# Altium schematic sheet dac-DAC7562.SchDoc: DAC7562
size A4; DrawnBy: Dylan Vogel; Organization: UTAT SS; Revision: 1.1
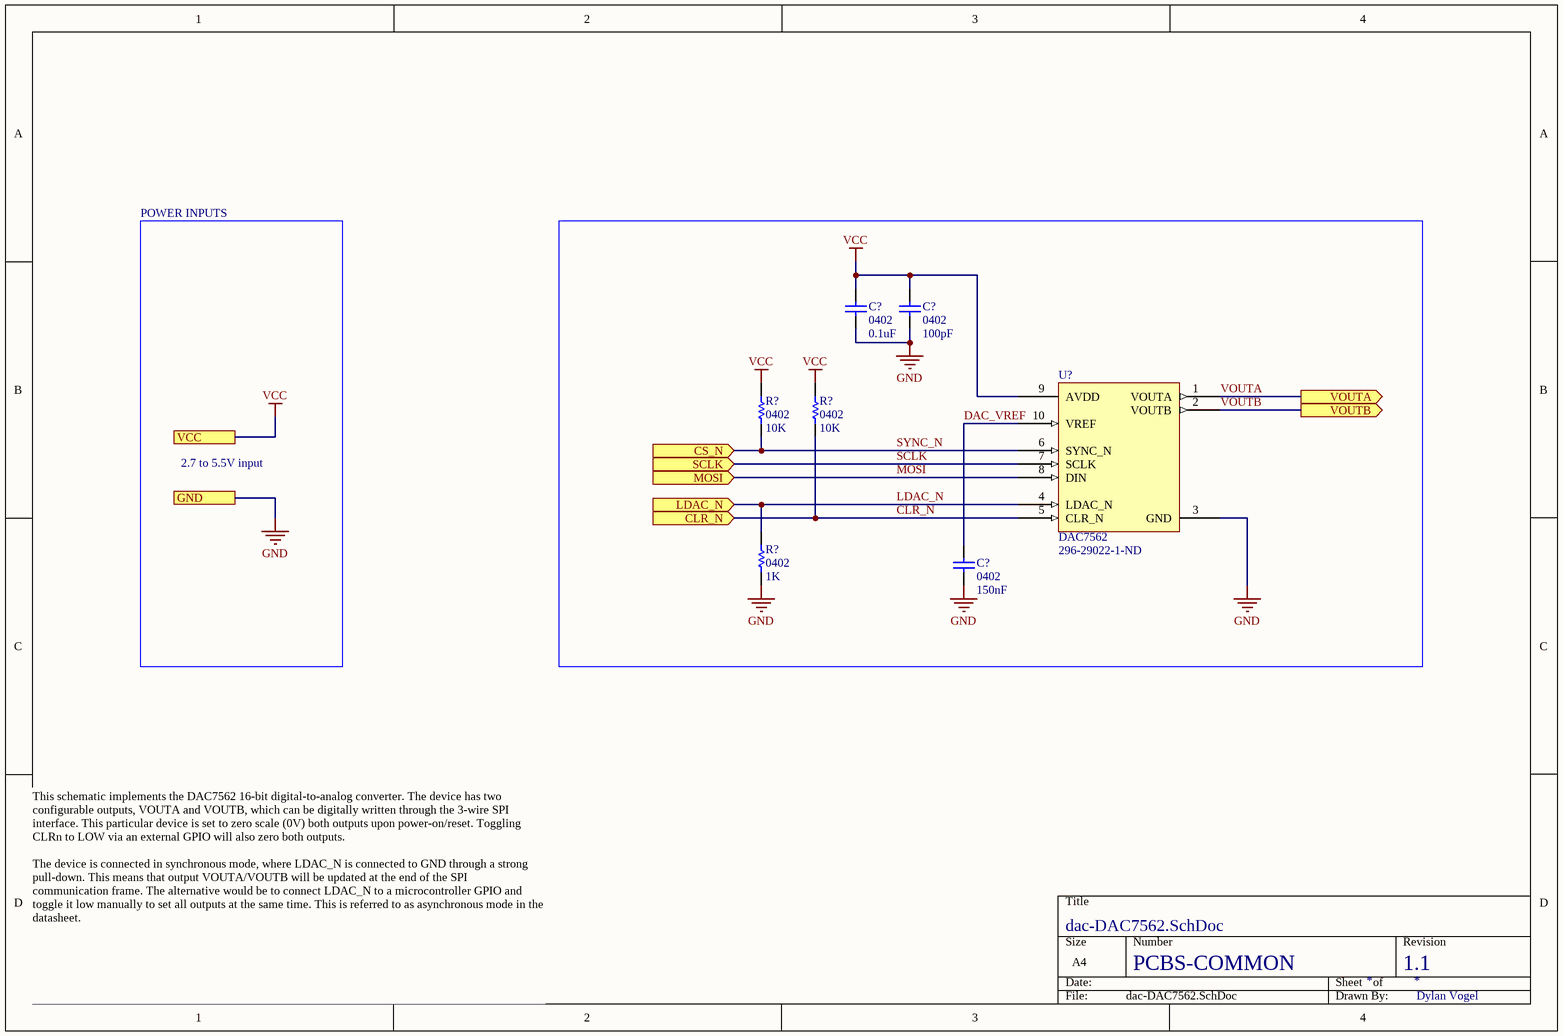
[diagram p0: dac-DAC7562.SchDoc]

## Parts
(Parts that share a designator on the sheet are numbered #1, #2 ... from top to bottom, then left to right.)
C?#1  0402  value 0.1uF  [CAP0402R]
C?#2  0402  value 100pF  [CAP0402R]
C?#3  0402  value 150nF  [CAP0402R]
R?#1  0402  value 10K  [RES0402R]
R?#2  0402  value 10K  [RES0402R]
R?#3  0402  value 1K  [RES0402R]
U?  DAC7562  Supplier Part Number 1: 296-29022-1-ND  [SSOP50P300X300-10N]

## Ports
CLR_N (in), CS_N (in), GND, LDAC_N (in), MOSI (in), SCLK (in), VCC, VOUTA (out), VOUTB (out)

## Nets
GND: C?#1.1 C?#2.1 C?#3.1 R?#3.1 U?.3(GND) ; port GND
VCC: C?#1.2 C?#2.2 R?#1.2 R?#2.2 U?.9(AVDD) ; port VCC
CLR_N: R?#2.1 U?.5(CLR_N) ; port CLR_N
DAC_VREF: C?#3.2 U?.10(VREF)
LDAC_N: R?#3.2 U?.4(LDAC_N) ; port LDAC_N
MOSI: U?.8(DIN) ; port MOSI
SCLK: U?.7(SCLK) ; port SCLK
SYNC_N: R?#1.1 U?.6(SYNC_N) ; port CS_N
VOUTA: U?.1(VOUTA) ; port VOUTA
VOUTB: U?.2(VOUTB) ; port VOUTB

## Notes on the sheet
- POWER INPUTS
- 2.7 to 5.5V input
- PCBS-COMMON
- This schematic implements the DAC7562 16-bit digital-to-analog converter. The device has two configurable outputs, VOUTA and VOUTB, which can be digitally written through the 3-wire SPI interface. This particular device is set to zero scale (0V) both outputs upon power-on/reset. Toggling CLRn to LOW via an external GPIO will also zero both outputs.
  The device is connected in synchronous mode, where LDAC_N is connected to GND through a strong pull-down. This means that output VOUTA/VOUTB will be updated at the end of the SPI communication frame. The alternative would be to connect LDAC_N to a microcontroller GPIO and toggle it low manually to set all outputs at the same time. This is referred to as asynchronous mode in the datasheet.

## Library data of the parts
C?#1 = CAP0402: 0402 capacitor; Manufacturer: Taiyo Yuden; Manufacturer Part Number: EMK105B7104KVHF; Description: Multilayer Ceramic Capacitors MLCC - SMD/SMT 0.1uF 16V X7R +/-10% 0402 AEC-Q200; Voltage Rating: 16V; Capacitance: 100nF; Tolerance: 10%; Dielectric: X7R; Supplier 1: Digi-Key; Supplier Part Number 1: 587-3807-1-ND; Stock 1: 18196; Pricing 1: 1=0.1, 10=0.057, 100=0.0254, 500=0.01812, 1000=0.01423, 2500=0.01294, 5000=0.0119 (USD); Mount: Surface Mount; Case/Package: 0402; Weight: 2.3E-05oz; Case Code (Metric): 1005; Case Code (Imperial): 0402; Min Operating Temperature: -55°C; Max Operating Temperature: 125°C; Package Quantity: 10000; Packaging: Tape and Reel; Termination: SMD/SMT; Voltage Rating (DC): 16V; Length: 0.039inch; Height: 0.5mm; Width: 0.02inch; Thickness: 0.022inch; Ratings: AEC-Q200; Lead Free: Lead Free; Halogen Free: Halogen Free
C?#2 = CAP0402: 0402 capacitor; Manufacturer: KEMET; Manufacturer Part Number: C0402C101J5RACAUTO; Description: CAP CER SMD 0402 100PF 5% X7R 50; Dielectric Material: Ceramic; Voltage Rating (DC): 50V; Dielectric: X7R; Tolerance: 5%; Supplier 1: Digi-Key; Supplier Part Number 1: 399-17545-1-ND; Stock 1: 193150; Pricing 1: 1=0.13, 10=0.092, 100=0.0409, 500=0.02918, 1000=0.02293, 2500=0.02084, 5000=0.01918 (USD); Case/Package: 0402; Capacitance: 100pF
C?#3 = CAP0402: 0402 capacitor; Manufacturer: TDK; Manufacturer Part Number: CGA2B1X7R1A154M050BC; Description: CAP CER 0.15UF 10V X7R 0402; Tolerance: 20%; Voltage Rating: 10V; Dielectric: X7R; Supplier 1: Digi-Key; Supplier Part Number 1: 445-12236-1-ND; Stock 1: 9983; Pricing 1: 1=0.15, 10=0.106, 100=0.05, 500=0.03508, 1000=0.02904, 2500=0.02702, 5000=0.02473 (USD); Mount: Surface Mount; Case/Package: 0402; Weight: 2.3E-05oz; Case Code (Metric): 1005; Case Code (Imperial): 0402; Min Operating Temperature: -55°C; Max Operating Temperature: 125°C; Package Quantity: 10000; Packaging: Tape and Reel; Capacitance: 150nF; Voltage Rating (DC): 10V; Length: 0.039inch; Height: 0.5mm; Width: 0.5mm; Thickness: 0.022inch; Ratings: AEC-Q200
R?#1 R?#2 = RES0402: 0402 resistor; Manufacturer: Panasonic; Manufacturer Part Number: ERJ-2RKF1002X; Description: RES SMD 10K OHM 1% 1/10W 0402; Resistance: 10kR; Power Rating: 100mW; Tolerance: 1%; Voltage Rating: 50V; Temperature Coefficient: 100ppm/°C; Supplier 1: Digi-Key; Supplier Part Number 1: P10.0KLCT-ND; Stock 1: 14350001; Pricing 1: 1=0.1, 10=0.045, 100=0.0183, 1000=0.00823, 2500=0.00715, 5000=0.0059 (USD); Mount: Surface Mount; Case/Package: 0402; Number of Pins: 2; Case Code (Metric): 1005; Case Code (Imperial): 0402; Contact Plating: Tin; Min Operating Temperature: -55°C; Max Operating Temperature: 155°C; Packaging: Tape and Reel; Package Quantity: 1; Composition: Thick Film; Number of Terminations: 2; Termination: SMD/SMT; Military Standard: Not; Max Power Dissipation: 100mW; Voltage Rating (DC): 50V; Features: Automotive AEC-Q200; Length: 1mm; Height: 0.35mm; Width: 0.02inch; Depth: 0.5mm; Radiation Hardening: No; REACH SVHC: No SVHC; Lead Free: Lead Free; ComponentLink1URL: http://industrial.panasonic.com/www-data/pdf/AOA0000/AOA0000CE2.pdf?src-supplier=Future+Electronics; ComponentLink1Description: http://industrial.panasonic.com/www-data/pdf/AOA0000/AOA0000CE2.pdf?src-supplier=Future+Electronics; ComponentLink2URL: http://industrial.panasonic.com/www-data/pdf/AOA0000/AOA0000CE2.pdf?src-supplier=Avnet+Europe; ComponentLink2Description: http://industrial.panasonic.com/www-data/pdf/AOA0000/AOA0000CE2.pdf?src-supplier=Avnet+Europe; ComponentLink3URL: https://industrial.panasonic.com/cdbs/www-data/pdf/RDA0000/DMA0000COL11.pdf?src-supplier=Mouser; ComponentLink3Description: https://industrial.panasonic.com/cdbs/www-data/pdf/RDA0000/DMA0000COL11.pdf?src-supplier=Mouser; ComponentLink4URL: http://www.farnell.com/datasheets/1678782.pdf?src-supplier=Element14; ComponentLink4Description: http://www.farnell.com/datasheets/1678782.pdf?src-supplier=Element14; ComponentLink5URL: http://www.farnell.com/datasheets/1911175.pdf?src-supplier=Farnell; ComponentLink5Description: http://www.farnell.com/datasheets/1911175.pdf?src-supplier=Farnell; ComponentLink6URL: http://www.jameco.com/Jameco/Products/ProdDS/1987020.pdf?src-supplier=Jameco; ComponentLink6Description: http://www.jameco.com/Jameco/Products/ProdDS/1987020.pdf?src-supplier=Jameco; ComponentLink7URL: http://industrial.panasonic.com/www-data/pdf/AOA0000/AOA0000CE2.pdf?src-supplier=Avnet; ComponentLink7Description: http://industrial.panasonic.com/www-data/pdf/AOA0000/AOA0000CE2.pdf?src-supplier=Avnet; ComponentLink8URL: http://www.alliedelec.com/m/d/623f45ff1957d936ff56d46fd1c28cac.pdf?src-supplier=Allied+Electronics; ComponentLink8Description: http://www.alliedelec.com/m/d/623f45ff1957d936ff56d46fd1c28cac.pdf?src-supplier=Allied+Electronics
R?#3 = RES0402: 0402 resistor; Manufacturer: Panasonic; Manufacturer Part Number: ERJ-PA2J102X; Description: RES SMD 1K OHM 5% 1/5W 0402; Resistance: 1kR; Tolerance: 5%; Max Power Dissipation: 200mW; Temperature Coefficient: 200ppm/°C; Supplier 1: Digi-Key; Supplier Part Number 1: P17193CT-ND; Stock 1: 7229; Pricing 1: 1=0.16, 10=0.133, 100=0.0518, 1000=0.0217, 2500=0.0199, 5000=0.01809 (USD); Case/Package: 0402; Case Code (Metric): 1005; Case Code (Imperial): 0402; Min Operating Temperature: -55°C; Max Operating Temperature: 155°C; Packaging: Tape and Reel; Composition: Thick Film; Number of Terminations: 2; Features: Automotive AEC-Q200; Length: 0.039inch; Height: 0.016inch; Width: 0.02inch
U? = DAC7562: 12-bit, low-power, voltage-output DAC with internal reference.; Supplier 1: Digi-Key